# EAGLE design PLO_v1 (EAGLE 7.1.0)
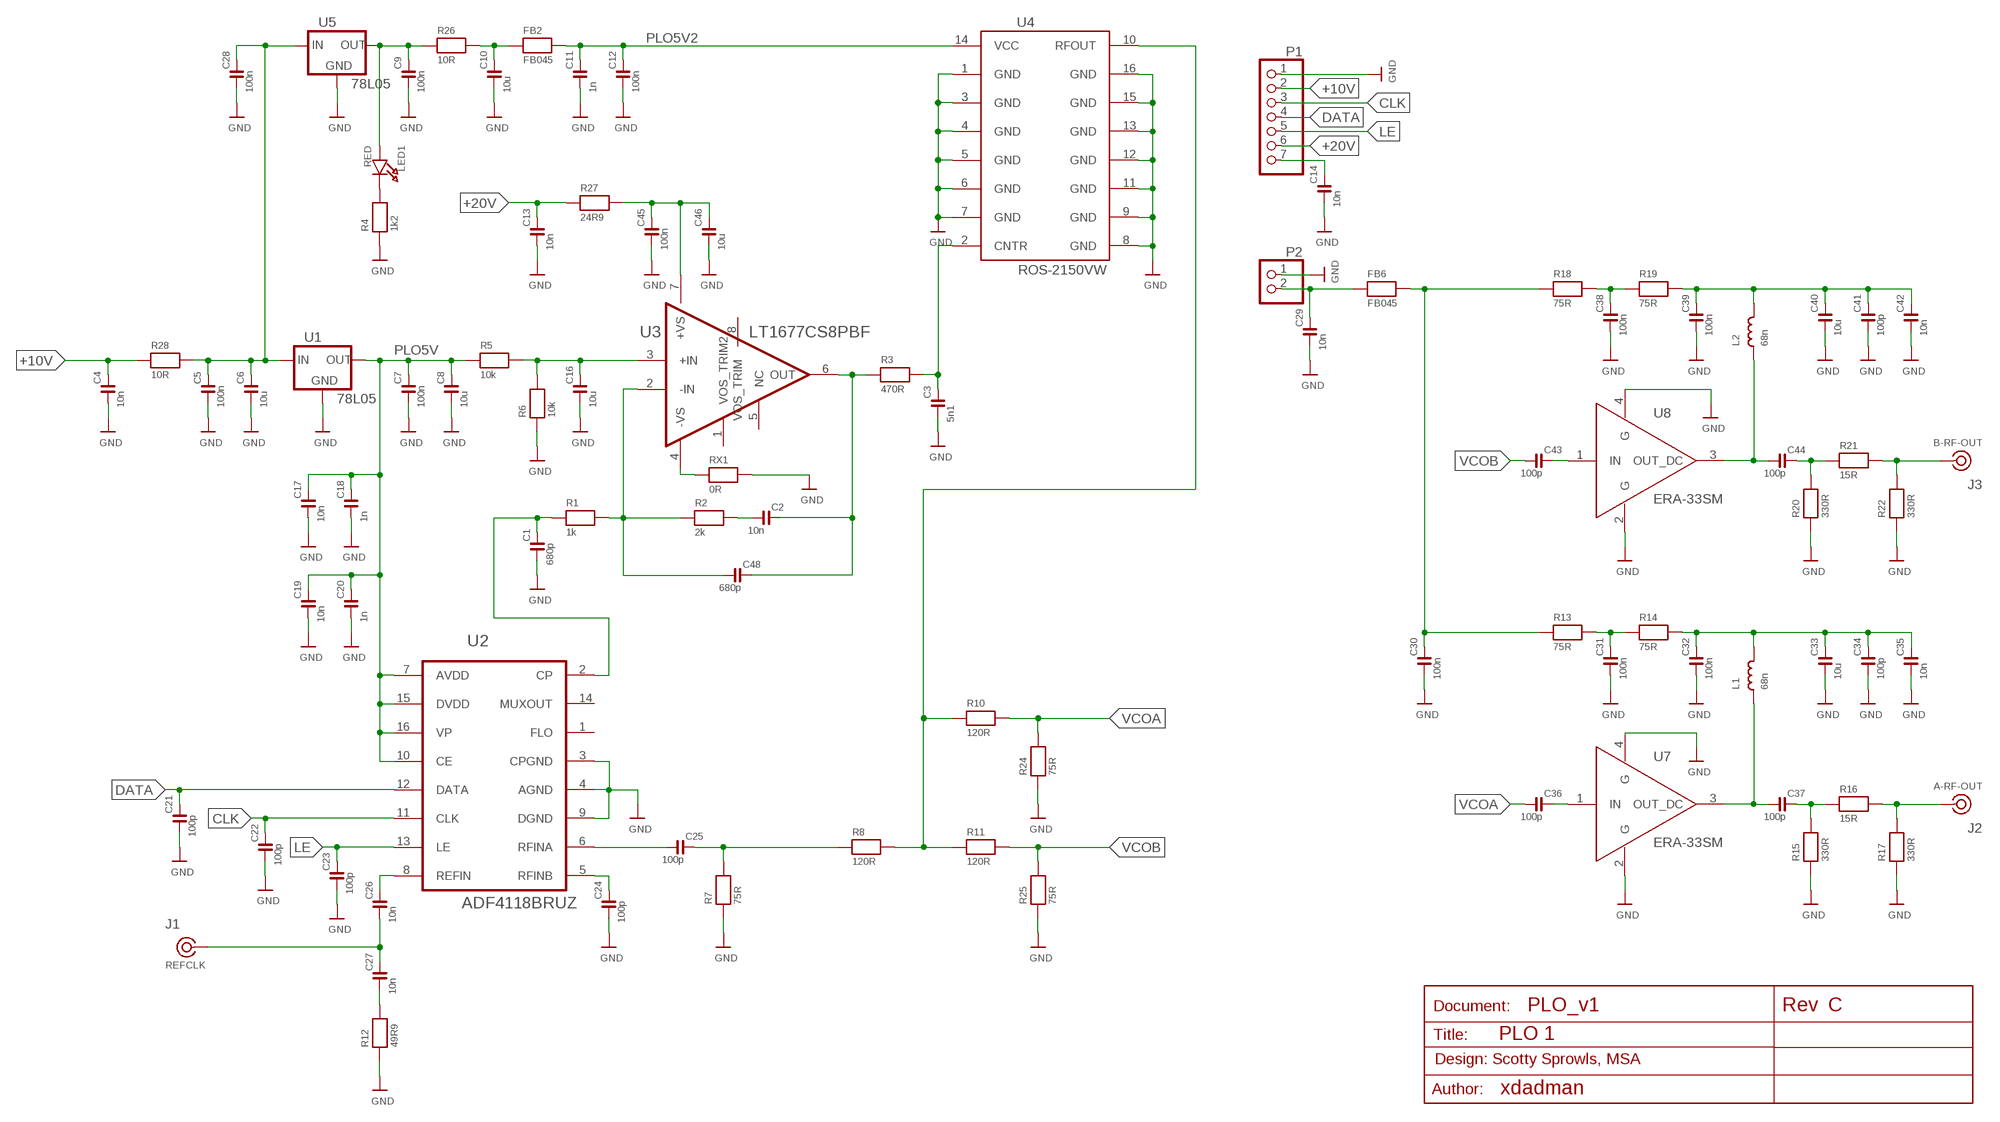
[diagram p0: schematic, sheet 1]

## Parts
C1  680p  C0805680P  [C0805]
C2  10n  C080510N  [C0805]
C3  5n1  C08055N1  [C0805]
C4  10n  C080510N  [C0805]
C5  100n  C0805100N  [C0805]
C6  10u  CC120610U  [C1206]
C7  100n  C0805100N  [C0805]
C8  10u  CC120610U  [C1206]
C9  100n  C0805100N  [C0805]
C10  10u  CC120610U  [C1206]
C11  1n  C08051N  [C0805]
C12  100n  C0805100N  [C0805]
C13  10n  C080510N  [C0805]
C14  10n  C080510N  [C0805]
C16  10u  CC120610U  [C1206]
C17  10n  C080510N  [C0805]
C18  1n  C08051N  [C0805]
C19  10n  C080510N  [C0805]
C20  1n  C08051N  [C0805]
C21  100p  C0805100P  [C0805]
C22  100p  C0805100P  [C0805]
C23  100p  C0805100P  [C0805]
C24  100p  C0805100P  [C0805]
C25  100p  C0805100P  [C0805]
C26  10n  C080510N  [C0805]
C27  10n  C080510N  [C0805]
C28  100n  C0805100N  [C0805]
C29  10n  C080510N  [C0805]
C30  100n  C0805100N  [C0805]
C31  100n  C0805100N  [C0805]
C32  100n  C0805100N  [C0805]
C33  10u  CC120610U  [C1206]
C34  100p  C0805100P  [C0805]
C35  10n  C080510N  [C0805]
C36  100p  C0805100P  [C0805]
C37  100p  C0805100P  [C0805]
C38  100n  C0805100N  [C0805]
C39  100n  C0805100N  [C0805]
C40  10u  CC120610U  [C1206]
C41  100p  C0805100P  [C0805]
C42  10n  C080510N  [C0805]
C43  100p  C0805100P  [C0805]
C44  100p  C0805100P  [C0805]
C45  100n  C0805100N  [C0805]
C46  10u  CC120610U  [C1206]
C48  680p  C0805680P  [C0805]
FB2  FB045  R0805FB045SPC  [R0805_SPC]
FB6  FB045  R0805FB045  [R0805]
J1  REFCLK  COAX  [SLIM_COAX_PAD]
J2  A-RF-OUT  COAX  [SLIM_COAX_PAD]
J3  B-RF-OUT  COAX  [SLIM_COAX_PAD]
L1  68n  L060368N  [0603-MINI]
L2  68n  L060368N  [0603-MINI]
LED1  RED  LED_0603_RED0603  [CHIPLED_0603]
P1  PINHD-1X7  [1X07]
P2  PINHD-1X2  [1X02]
R1  1k  R08051K  [R0805]
R2  2k  R08052K  [C0805]
R3  470R  R0805470R  [R0805]
R4  1k2  R08051K2  [R0805]
R5  10k  R080510K  [R0805]
R6  10k  R080510K  [R0805]
R7  75R  R080575R  [R0805]
R8  120R  R0805120R  [R0805]
R10  120R  R0805120R  [R0805]
R11  120R  R0805120R  [R0805]
R12  49R9  R080549R9  [R0805]
R13  75R  R080575R  [R0805]
R14  75R  R080575R  [R0805]
R15  330R  R0805330R  [R0805]
R16  15R  R080515R  [0805]
R17  330R  R0805330R  [R0805]
R18  75R  R080575R  [R0805]
R19  75R  R080575R  [R0805]
R20  330R  R0805330R  [R0805]
R21  15R  R080515R  [0805]
R22  330R  R0805330R  [R0805]
R24  75R  R080575R  [R0805]
R25  75R  R080575R  [R0805]
R26  10R  R080510R  [R0805]
R27  24R9  R080524R9  [R0805]
R28  10R  R080510R  [R0805]
RX1  0R  R08050R  [R0805]
U1  78L05  78MXXL78L05  [SOT89]
U2  ADF4118BRUZ  [SOIC65P640X120-16N]
U3  LT1677CS8PBF  [SOIC127P600X175-8N_JDA2]
U4  ROS-2150VW  [ROS-2150VW]
U5  78L05  78MXXL78L05  [SOT89]
U7  ERA-33SM  [WW107]
U8  ERA-33SM  [WW107]

## Nets
+10V: C4.2 P1.2 R28.1
+20V: C13.2 P1.6 R27.1
CLK: C22.2 P1.3 U2.11(CLK)
DATA: C21.2 P1.4 U2.12(DATA)
DATA1: C24.2 U2.5(RFINB)
DATA2: C39.2 C40.2 C41.2 C42.2 L2.2 R19.2
DATA3: C32.2 C33.2 C34.2 C35.2 L1.2 R14.2
GND: C1.1 C3.1 C4.1 C5.1 C6.1 C7.1 C8.1 C9.1 C10.1 C11.1 C12.1 C13.1 C14.1 C16.1 C17.1 C18.1 C19.1 C20.1 C21.1 C22.1 C23.1 C24.1 C28.1 C29.1 C30.1 C31.1 C32.1 C33.1 C34.1 C35.1 C38.1 C39.1 C40.1 C41.1 C42.1 C45.1 C46.1 P1.1 P2.1 R4.1 R6.1 R7.1 R12.1 R15.1 R17.1 R20.1 R22.1 R24.1 R25.1 RX1.2 U1.2(GND) U1.4(GND) U2.3(CPGND) U2.4(AGND) U2.9(DGND) U4.1(GND) U4.3(GND) U4.4(GND) U4.5(GND) U4.6(GND) U4.7(GND) U4.8(GND) U4.9(GND) U4.11(GND) U4.12(GND) U4.13(GND) U4.15(GND) U4.16(GND) U5.2(GND) U5.4(GND) U7.2(G) U7.4(G) U8.2(G) U8.4(G)
LE: C23.2 P1.5 U2.13(LE)
N$1: C5.2 C6.2 C28.2 R28.2 U1.3(IN) U5.3(IN)
N$2: C9.2 LED1.A R26.1 U5.1(OUT)
N$3: C10.2 FB2.1 R26.2
N$5: C48.1 R1.2 R2.1 U3.2(-IN)
N$6: C2.1 R2.2
N$7: C16.2 R5.2 R6.2 U3.3(+IN)
N$8: C2.2 C48.2 R3.1 U3.6(OUT)
N$9: C1.2 R1.1 U2.2(CP)
N$10: C3.2 R3.2 U4.2(CNTR)
N$11: RX1.1 U3.4(-VS)
N$12: LED1.C R4.2
N$13: C26.2 U2.8(REFIN)
N$14: C26.1 C27.2 J1.SIG
N$15: C27.1 R12.2
N$16: C25.2 R7.2 R8.1
N$17: C25.1 U2.6(RFINA)
N$18: R8.2 R10.1 R11.1 U4.10(RFOUT)
N$19: C30.2 FB6.2 R13.1 R18.1
N$20: C29.2 FB6.1 P2.2
N$22: C38.2 R18.2 R19.1
N$23: C44.2 R20.2 R21.1
N$24: J3.SIG R21.2 R22.2
N$25: C14.2 P1.7
N$26: C44.1 L2.1 U8.3(OUT_DC)
N$28: C43.2 U8.1(IN)
N$29: C31.2 R13.2 R14.1
N$30: C37.2 R15.2 R16.1
N$31: J2.SIG R16.2 R17.2
N$32: C37.1 L1.1 U7.3(OUT_DC)
N$33: C36.2 U7.1(IN)
PLO5V: C7.2 C8.2 C17.2 C18.2 C19.2 C20.2 R5.1 U1.1(OUT) U2.7(AVDD) U2.10(CE) U2.15(DVDD) U2.16(VP)
PLO5V2: C11.2 C12.2 FB2.2 U4.14(VCC)
VCOA: C36.1 R10.2 R24.2
VCOB: C43.1 R11.2 R25.2
XYZ: C45.2 C46.2 R27.2 U3.7(+VS)
Unconnected: U2.1(FLO) U2.14(MUXOUT) U3.1(VOS_TRIM2) U3.5(NC) U3.8(VOS_TRIM)

## Notes on the sheet
- C
- PLO 1
- Design: Scotty Sprowls, MSA
- xdadman

## Power pins joined to a net without a drawn wire
GND: J1.GND J2.GND J3.GND

## Library data of the parts
C1 C48 = MSA_lib:C0805: Ceramic capacitor; OC_FARNELL: 2332409
C2 C4 C13 C14 C17 C19 C26 C27 C29 C35 C42 = MSA_lib:C0805: Ceramic capacitor; OC_FARNELL: 1414662
C3 = MSA_lib:C0805: Ceramic capacitor; OC_FARNELL: 1865495
C5 C7 C9 C12 C28 C30-C32 C38 C39 C45 = MSA_lib:C0805: Ceramic capacitor; OC_FARNELL: 1759166
C6 C8 C10 C16 C33 C40 C46 = MSA_lib:CC1206: Capacitor ceramic 1206; OC_FARNELL: 1611967
C11 C18 C20 = MSA_lib:C0805: Ceramic capacitor; OC_FARNELL: 1833879
C21-C25 C34 C36 C37 C41 C43 C44 = MSA_lib:C0805: Ceramic capacitor; OC_FARNELL: 1414656
FB2 FB6 = MSA_lib:R0805: Resistors; OC_FARNELL: 1515661
J1-J3 = MSA_lib:COAX
L1 L2 = MSA_lib:L0603: Inductor SMD 0603; OC_FARNELL: 2286224
LED1 = MSA_lib:LED_0603_RED: Chip LED 0603 RED 2ma; OC_FARNELL: 1685068
P1 = MSA_lib:PINHD-1X7: PIN HEADER
P2 = MSA_lib:PINHD-1X2: PIN HEADER
R1 = MSA_lib:R0805: Resistors; OC_FARNELL: 2008380
R2 = MSA_lib:R0805: Resistors; OC_FARNELL: 1887288
R3 = MSA_lib:R0805: Resistors; OC_FARNELL: 2332067
R4 = MSA_lib:R0805: Resistors; OC_FARNELL: 9333827
R5 R6 = MSA_lib:R0805: Resistors; OC_FARNELL: 2073607
R7 R13 R14 R18 R19 R24 R25 = MSA_lib:R0805: Resistors; OC_FARNELL: 2332056
R8 R10 R11 = MSA_lib:R0805: Resistors; OC_FARNELL: 2332059
R12 = MSA_lib:R0805: Resistors; OC_FARNELL: 2312274
R15 R17 R20 R22 = MSA_lib:R0805: Resistors; OC_FARNELL: 2078951
R16 R21 = MSA_lib:R0805: Resistors; OC_FARNELL: 2332045
R26 R28 = MSA_lib:R0805: Resistors; OC_FARNELL: 2332043
R27 = MSA_lib:R0805: Resistors; OC_FARNELL: 2326793
RX1 = MSA_lib:R0805: Resistors; OC_FARNELL: 2057661
U1 U5 = MSA_lib:78MXXL: VOLTAGE REGULATOR; OC_FARNELL: 1366573
U2 = MSA_lib:ADF4118BRUZ: RF PLL Frequency Synthesizers; MPN: ADF4118BRUZ; OC_FARNELL: 2377107; OC_NEWARK: 59K1043; PACKAGE: TSSOP-16; SUPPLIER: ANALOG DEVICES
U3 = MSA_lib:LT1677CS8PBF: 1.1MHz, 0.4V/ìs Over-The-Top Micropower, Rail-To-Rail Input and Output Op Amp; MPN: LT1677CS8#PBF; OC_FARNELL: 1330687; OC_NEWARK: 57M5685; PACKAGE: SOIC-8; SUPPLIER: Linear Technology
U4 = MSA_lib:ROS-2150VW: Voltage controlled oscilator; VENDOR: minicirquits
U7 U8 = MSA_lib:ERA-33SM: Monolithic Amplifier 3Ghz; VENDOR: minicirquits

## Board

Size 32 x 64 mm. Coordinates in mm from the lower left corner, seen from the top.
Outline: 0,0 32,0 32,64 0,64 0,0
Copper layers (1*16): Top 0.035mm / dielectric 1.5mm / Bottom 0.035mm
Design rules "kuba_no_CLR": minimum track width 8mil, minimum drill 15mil, track to track 8mil, track to pad 8mil, pad to pad 8mil, via to via 8mil, smd to smd 8mil, copper to edge 0mil, drill to drill 8mil, minimum pad ring 12mil, minimum via ring 10mil, stop-mask expansion 4mil, vias tented up to drill 0mil, thermal gap 10mil

### Footprints (pad centres in the part's own frame; a part is rotated, then mirrored left to right if it is on the bottom)
C0805 = smd 1.2 x 1.5: 1 -0.953,0; 2 0.953,0
C1206 = smd 1.6 x 1.8: 1 -1.4,0; 2 1.4,0
R0805_SPC = smd 1.021 x 1.5: 1 -1.102,0 | smd 1.046 x 1.5: 2 1.077,0
R0805 = smd 1.3 x 1.5: 1 -0.95,0; 2 0.95,0
SLIM_COAX_PAD = smd 1.27 x 0.635 bottom: GND 0,-2.667 | drill 1.1: SIG 0,0
0603-MINI = smd 0.9 x 0.9: 1 -0.75,0; 2 0.75,0
CHIPLED_0603 = smd 0.8 x 0.8: A 0,-0.75; C 0,0.75
1X07 = drill 1.016: 1 -7.62,0; 2 -5.08,0; 3 -2.54,0; 4 0,0; 5 2.54,0; 6 5.08,0; 7 7.62,0
1X02 = drill 1.016: 1 -1.27,0; 2 1.27,0
0805 = smd 1.3 x 1.5: 1 -0.95,0; 2 0.95,0
SOT89 = smd 1.2 x 1.5: 1 -1.6,-2; 3 1.6,-2 | smd 1 x 1.5: 2 0,-2 | smd 2.4 x 3: 4 0,1.25
SOIC65P640X120-16N = smd 1.473 x 0.356: 1 -2.819,2.286; 2 -2.819,1.626; 3 -2.819,0.965; 4 -2.819,0.33; 5 -2.819,-0.33; 6 -2.819,-0.965; 7 -2.819,-1.626; 8 -2.819,-2.286; 9 2.819,-2.286; 10 2.819,-1.626; 11 2.819,-0.965; 12 2.819,-0.33; 13 2.819,0.33; 14 2.819,0.965; 15 2.819,1.626; 16 2.819,2.286
SOIC127P600X175-8N_JDA2 = smd 1.981 x 0.559: 1 -2.362,1.905; 2 -2.362,0.635; 3 -2.362,-0.635; 4 -2.362,-1.905; 5 2.362,-1.905; 6 2.362,-0.635; 7 2.362,0.635; 8 2.362,1.905
ROS-2150VW = smd 1.52 x 1.52: 1 0,0; 2 2.54,0; 3 5.08,0; 4 7.62,0; 5 9.53,2.67; 6 9.53,5.21; 7 9.53,7.75; 8 9.53,10.29; 9 6.73,12.2; 10 4.19,12.2; 11 1.65,12.2; 12 -0.89,12.2; 13 -2.67,10.29; 14 -2.67,7.75; 15 -2.67,5.21; 16 -2.67,2.67
WW107 = smd 1.02 x 1.83: 1 0,-2.1; 3 0,2.1 | smd 1.83 x 1.02: 2 2.1,0; 4 -2.1,0

### Placement (x,y rotation side)
C1  17.91,29.59 90 top
C2  23.24,29.59 270 top
C3  26.8,29.59 90 top
C4  9.4,13.72 0 top
C5  5.46,13.72 180 top
C6  8.64,6.6 270 top
C7  5.33,20.32 180 top
C8  5.97,22.23 180 top
C9  18.16,3.94 90 top
C10  26.29,4.45 90 top
C11  18.8,34.42 0 top
C12  18.8,32.51 0 top
C13  20.83,9.02 90 top
C14  22.99,15.24 180 top
C16  18.8,18.16 90 top
C17  16.64,18.8 90 top
C18  14.73,18.8 90 top
C19  9.27,25.15 90 top
C20  8.38,32.26 0 top
C21  15.75,9.02 90 top
C22  13.08,9.02 90 top
C23  18.29,9.02 90 top
C24  14.35,31.62 180 top
C25  12.32,34.42 90 top
C26  8.38,30.48 0 top
C27  4.57,30.48 0 top
C28  11.18,3.81 90 top
C29  7.87,60.71 270 top
C30  13.46,60.71 270 top
C31  3.94,57.78 0 top
C32  7.75,52.83 90 top
C33  9.91,52.96 90 top
C34  4.83,51.82 180 top
C35  4.83,53.59 180 top
C36  11.18,45.97 90 top
C37  3.43,46.23 270 top
C38  15.37,57.78 180 top
C39  23.11,59.94 270 top
C40  27.56,59.31 180 top
C41  20.07,56.9 0 top
C42  20.07,58.67 0 top
C43  12.32,52.96 90 top
C44  21.84,51.56 270 top
C45  26.04,19.3 0 top
C46  25.4,17.27 0 top
C48  23.5,26.67 0 top
FB2  25.91,33.53 180 top
FB6  10.67,59.69 0 top
J1  6.35,28.19 0 top
J2  6.99,39.75 270 top
J3  25.15,53.34 90 top
L1  3.68,49.53 90 top
L2  21.72,54.61 90 top
LED1  20.7,4.32 270 top
P1  15.75,11.94 0 top
P2  4.45,60.33 0 top
R1  19.68,29.59 270 top
R2  21.46,29.59 90 top
R3  25.02,29.59 90 top
R4  23.5,3.3 90 top
R5  18.03,22.86 0 top
R6  18.03,24.77 0 top
R7  12.45,37.21 180 top
R8  12.19,40.01 90 top
R10  12.32,43.18 180 top
R11  13.08,46.74 90 top
R12  4.57,32.26 180 top
R13  7.75,57.78 180 top
R14  4.7,55.75 0 top
R15  5.71,45.21 180 top
R16  4.45,41.91 0 top
R17  4.83,38.99 90 top
R18  11.56,57.78 0 top
R19  16.26,59.69 0 top
R20  19.05,50.55 0 top
R21  24.64,50.55 0 top
R22  28.45,50.55 180 top
R24  8.76,43.94 0 top
R25  13.84,50.16 180 top
R26  23.11,6.1 0 top
R27  23.75,10.03 0 top
R28  11.18,7.87 270 top
RX1  22.23,19.3 0 top
U1  6.35,17.02 270 top
U2  13.08,26.54 270 top
U3  23.5,22.99 0 top
U4  27.56,38.99 90 top
U5  14.61,4.32 180 top
U7  7.62,48.01 90 top
U8  16.51,53.72 270 top

### Tracks (layer width: path | path; a pad name or v marks a point on that pad's centre or on a via)
+10V
  Top 0.813: R28.1 10.67,9.33 P1.2 10.67,13.4 C4.2
+20V
  Top 0.813: P1.6 C13.2 22.73,9.97 R27.1
CLK
  Top 0.305: U2.11 12.12,13.03 P1.3
  Top 0.813: C22.2 13.08,11.81 P1.3
DATA
  Top 0.305: U2.12 12.75,14.94 P1.4
  Top 0.813: C21.2 P1.4
DATA1
  Top 0.305: U2.5 12.75,30.98 C24.2
DATA2
  Top 0.61: R19.2 17.97,60.45 20.32,60.45 21.02,59.75 C42.2 C41.2
  Top 0.813: L2.2 21.72,56.2 C41.2 | C42.2 22.8,58.67 C39.2 23.3,58.99 23.5,58.8 23.5,58.93
  Top 1.016: C39.2 25.84,58.99 C40.2
DATA3
  Top 0.406: C35.2 3.87,53.66 5.46,55.24 5.46,55.56 R14.2
  Top 0.813: L1.2 3.68,51.63 C34.2 C35.2
  Top 1.016: R14.2 7.75,55.75 | 7.75,55.75 9.07,55.75 9.5,55.32 9.5,54.77 C33.2 | C32.2 7.75,55.75
GND  (via drill 0.5)  (2 unrouted)
  Top 0.305: U2.3 14.05,30.3 14.61,30.86 14.61,30.92 C24.1 15.3,32.96 v15.49,33.15 | U2.4 U2.3 | U2.3 14.05,28.02 v13.72,27.69 | C12.1 C11.1 v16.13,34.42 | v9.27,23.24 C19.1 9.74,23.72 U2.9 | U1.2 5.59,17.02 6.59,18.02 | C13.1 17.34,8.06 v17.14,7.87 | 16.51,56.9 v16.76,57.15 | C39.1 v23.11,61.8 | C40.1 30.28,59.31 v30.3,59.28 | R17.1 v4.83,37.08 | 1.22,1.65 2.23,1.65 2.26,1.63 | 13.41,29.21 13.41,28.02 13.72,27.71
  Top 0.406: U4.13 17.27,37.59 | 16.76,38.1 | C3.1 v26.8,27.69 | R20.1 18.1,50.48 17.72,50.1 | C13.1 17.23,8.06 17.12,7.95 | C10.1 26.29,1.8 26.16,1.68 18.39,1.68 18.16,1.91 | 1.22,1.65 1.22,2.87 | 1.63,1.65 1.63,2.87 | 1.98,1.63 1.98,2.85 | 2.31,1.6 2.31,2.82 | 0.15,1.6 0.15,2.82 | 0.91,1.6 0.91,2.82 | 0.53,1.6 0.53,2.82
  Top 0.61: C18.1 C17.1 v16.64,16.64 16.76,16.76 C16.1 | R6.1 17.08,26.48 v17.27,26.67 17.91,27.3 C1.1 | C45.1 RX1.2 23.18,17.46 22.99,17.27 | 22.99,17.27 C46.1 23.94,17.21 C14.1 | 22.99,17.27 v22.23,17.27 | 6.35,32.26 C20.1 | R12.1 6.35,32.26 | 6.35,32.26 v6.35,33.53
  Top 0.813: C6.1 8.13,8.51 P1.1 8.13,13.4 C4.1 | C22.1 14.48,8.06 | 14.48,8.06 C21.1 C23.1 C13.1 | U5.2 14.61,7.94 14.48,8.06 | U4.12 14.28,38.1 R7.1 | 6.93,45.21 7.49,45.21 7.75,44.96 | R24.1 7.81,44.64 7.75,44.7
  Top 1.016: C19.1 7.37,22.29 C8.1 7.62,21.97 7.62,21.84 6.29,20.51 C7.1 6.29,18.33 6.59,18.02 U1.4 7.6,13.74 7.62,13.72 | C5.1 7.62,13.72 | 7.62,13.72 C4.1 | 16.51,56.9 U8.4 v16.51,51.56 | 16.51,56.9 16.51,57.59 C38.1 | C42.1 C41.1 16.51,56.9 | 7.62,51.75 U7.2 U7.4 6.93,45.21 R15.1 | 7.62,51.75 C32.1 9.59,51.88 C33.1 | 7.62,51.75 5.84,51.75 C34.1 C35.1 | 2.16,36.45 7.87,36.45 9.53,38.1 v9.53,41.15 7.75,42.93 7.75,44.7 7.75,44.96 7.75,45.34 | C9.1 18.16,1.91 18.03,1.78 14.48,1.78 | 14.48,1.78 14.48,2.94 U5.4 | C28.1 11.18,1.78 14.48,1.78 | 16.59,58.17 18.64,58.17 | 18.64,58.17 18.64,58.19 | 18.64,58.17 18.64,57.48 16.92,57.48 16.92,57.53
  Top 1.524: R25.1 17.65,50.16 17.72,50.1 17.78,50.04 17.78,49.03 U4.8 16.51,49.28 v16.51,51.56 U8.2
  Bottom 0.305: v13.72,27.69 13.59,27.69 | v15.49,33.15 15.37,33.27 | v16.13,34.42 16,34.42 | v9.27,23.24 9.27,22.99 | v17.14,7.87 16.76,7.87 | v23.11,61.8 23.22,61.8 | v30.3,59.28 30.3,59.38
  Bottom 0.406: v26.8,27.69 26.8,27.46
  Bottom 0.61: v16.64,16.64 16.64,16.38 | v17.27,26.67 17.53,26.92 | v22.23,17.27 22.23,17.53 | v6.35,33.53 6.35,33.66
  other vias: 15.75,47.5 17.27,46.99 19.81,46.99 22.35,46.99 24.89,46.99 26.8,48.13 26.04,44.2 25.1,42.52 25.12,40.44 26.01,45.85 26.06,38.89 24.82,37.85 22.33,37.85 16.94,37.92 15.75,36.58 16.92,40.56 17.81,42.01 17.83,44.32 21.46,42.75 17.02,48.9 15.24,50.04 17.53,50.29 18.8,57.15 18.67,58.29 17.65,57.91 1.78,36.45 7.75,36.45 9.4,38.1 7.75,43.31 7.62,48.01 7.62,45.97 7.62,44.58 1.75,33.32 1.75,30.38 1.78,27.33 1.75,23.95 1.75,20.65 1.68,16.71 1.73,11.99 1.68,6.83 1.68,1.8 5.84,1.68 11.13,1.7 16.08,1.7 20.88,1.7 26.09,1.75 30.2,1.7 30.3,6.43 30.35,10.79 30.38,15.65 30.33,19.68 30.3,23.22 30.4,28.35 30.28,33.35 30.33,38.02 30.3,43.1 30.3,47.93 30.35,53.49 30.43,56.18 30.28,62.1 30.28,50.42 17.14,62.28 11.07,62.28 4.83,62.46 1.75,62.2 1.75,57.78 1.68,53.16 1.68,48.64 1.75,44.32 1.73,40.54 6.3,51.74 7.59,51.69 8.92,51.74 6.15,52.98 13.74,30.15 6.43,16.99 8.23,16.94 14.4,7.95 14.55,5.11 16.51,53.72
  pour Top (no thermals): 0,0 32,0 32,64.01 0,64.01 0,2.54 2.41,2.54 2.41,61.59 29.84,61.59 29.84,2.16 0,2.16
  pour Top (no thermals): 15.11,36.07 27.81,36.07 27.81,48.9 15.11,48.9
  pour Bottom: 0,0 32,0 32,64.01 0,64.01
LE
  Top 0.305: U2.13 13.41,16.82 P1.5
  Top 0.813: C23.2 P1.5
N$1
  Top 0.813: U1.3 4.35,13.87 C5.2 4.45,13.65 4.45,6.35 5.59,5.2 C6.2 10.73,5.2 C28.2 11.18,6.22 | 11.18,6.22 R28.2 | U5.3 11.27,6.32 11.18,6.22
N$2
  Top 0.406: 18.35,4.89 18.61,4.89 19.18,4.32 LED1.A
  Top 0.813: U5.1 16.2,6.27 17.53,4.95 18.1,4.95 C9.2 18.35,4.89 19.43,5.97 22.04,5.97 R26.1
N$3
  Top 0.813: FB2.1 27.94,33.53 28.7,32.77 28.7,8.26 C10.2 26.04,6.1 R26.2
N$5
  Top 0.61: U3.2 22.23,23.62 22.73,24.13 22.73,26.48 C48.1 22.48,26.67 21.46,27.69 R2.1 R1.2
N$6
  Top 0.61: R2.2 C2.1
N$7
  Top 0.61: C16.2 18.8,22.35 | 18.8,22.35 18.8,22.67 R5.2 R6.2 | U3.3 18.8,22.35
N$8
  Top 0.61: U3.6 24.77,22.35 24.26,22.86 24.26,26.48 C48.2 24.45,27.11 25.02,27.69 R3.1 C2.2
N$9
  Top 0.305: U2.2 14.71,30.2 14.99,30.48 17.84,30.48 C1.2 R1.1
N$10
  Top 0.305: U4.2 27.79,41.53 28.96,40.36 28.96,36.2 27.81,35.05 26.54,35.05 25.91,34.42 25.91,30.48 25.85,30.54 R3.2 26.1,30.54 26.16,30.48 26.73,30.48 C3.2
N$11
  Top 0.61: U3.4 21.03,19.55 RX1.1
N$12
  Top 0.406: LED1.C 23.43,4.32 R4.2
N$13
  Top 0.305: 10.67,29.46 10.69,29.46 U2.8
  Top 0.61: C26.2 9.34,30.04 9.91,29.46 10.67,29.46
N$14
  Top 1.016: J1.SIG 6.35,30.48 C27.2 C26.1
N$15
  Top 0.61: C27.1 R12.2
N$16
  Top 0.813: C25.2 12.32,35.81 11.68,36.45 11.68,37.02 R7.2 11.5,37.91 11.94,38.35 11.94,38.8 R8.1
N$17
  Top 0.305: U2.6 12.12,33.26 C25.1
N$18
  Top 0.406: 13.97,43.18 R10.1
  Top 0.813: R8.2 12.19,41.4 13.21,42.42 13.21,43.12 R10.1 13.27,45.6 R11.1
  Top 1.524: U4.10 13.97,43.18
N$19
  Top 0.61: R18.1 10.61,57.98 11.05,58.42 11.05,58.67 11.3,58.93 11.3,59.38 FB6.2
  Top 0.813: FB6.2 13.4,59.69 C30.2 | R13.1 R18.1
N$20
  Top 0.813: C29.2 9.65,59.75 FB6.1
  Top 1.016: C29.2 6.29,59.75 P2.2
N$22
  Top 0.61: C38.2 14.41,58.1 14.99,58.67 14.99,59.37 R19.1
  Top 0.813: C38.2 R18.2
N$23
  Top 0.813: R20.2 21.78,50.55 C44.2 23.62,50.61 R21.1
N$24
  Top 0.813: R21.2 R22.2
  Top 1.016: R21.2 25.59,52.9 J3.SIG
N$25
  Top 0.61: C14.2 22.04,14.8 23.24,13.59 23.24,12.06 P1.7
N$26
  Top 0.813: U8.3 21.58,53.72 L2.1 21.72,52.64 C44.1
N$28
  Top 0.813: U8.1 12.51,53.72 C43.2
N$29
  Top 0.61: R14.1 3.75,56.07 4.7,57.02 4.7,57.59 C31.2
  Top 0.813: C31.2 R13.2
N$30
  Top 1.016: R16.1 3.43,41.98 C37.2 4.7,45.28 R15.2
N$31
  Top 1.016: R16.2 5.39,40.51 R17.2 5.01,39.75 J2.SIG
N$32
  Top 0.813: L1.1 3.68,48.26 3.81,48.13
  Top 1.016: U7.3 3.94,48.01 3.81,48.13 3.81,47.56 C37.1
N$33
  Top 1.016: C36.2 11.18,47.12 10.29,48.01 U7.1
PLO5V
  Top 0.305: C20.2 9.84,31.75 10.54,31.75 11.46,30.84 U2.7 11.46,26.25 11.3,26.1 | U2.10 11.46,26.07 11.43,26.1 | 14.99,23.85 15.24,23.85 U2.16 15.37,24.13
  Top 0.406: U2.15 14.71,24.23 14.99,24.51 15.37,24.13
  Top 0.61: C18.2 C17.2 16.76,19.88 16.76,22.1 17.08,22.42 R5.1
  Top 0.813: 14.99,24.51 14.99,25.65 14.54,26.1 11.43,26.1 11.3,26.1 C19.2 9.21,26.04 5.46,26.04 4.57,25.14 C8.2 4.38,22.04 C7.2 4.35,20.29 U1.1 | C18.2 14.73,20.07 14.99,20.32 14.99,23.85
PLO5V2
  Top 0.813: FB2.2 19.94,33.53 | 19.94,33.53 19.81,33.4 19.81,32.58 C12.2 | C11.2 19.75,33.72 19.94,33.53
  Top 1.524: C11.2 19.75,36.26 U4.14
VCOA
  Top 0.61: 10.79,43.94 11.37,43.94
  Top 1.016: R10.2 11.37,43.94 11.37,44.83 C36.1
  Top 1.27: R24.2 10.79,43.94
VCOB
  Top 0.813: R11.2 13.08,49.98 R25.2 12.32,50.74 C43.1
XYZ
  Top 0.61: U3.7 27.3,23.62 27.56,23.37 27.56,19.88 C45.2 | C46.2 26.8,12.13 R27.2
  Top 0.813: C46.2 26.8,19.12 C45.2

### Text on the board
tPlace: FB6 | R19 | C42 | C40 | P2 | C39 | R13 | R18 | C38 | J3-BRF | R14 | C43 | C30 | C41 | C32 | L2 | R20 | C44 | R21 | R22 | U8 | C33 | L1 | R25 | R11 | R15 | C36 | C37 | R16 | R24 | R10 | U4 | R8 | R17 | J2-ARF | C11 | R12 | C20 | C25 | C12 | FB2 | R2 | C2 | R3 | C3 | C24 | C27 | C26 | C1 | U2 | R1 | J1-RCLK | R6 | C48 | U3 | C19 | C8 | C17 | R5 | RX1 | C7 | U1 | C45 | C18 | C4 | C16 | C46 | C14 | C5 | P1 | R28 | C22 | C21 | C23 | R27 | C13 | R26 | C10 | C9 | C6 | U5 | C28 | LED | R4